# Altium schematic sheet SCH_7Seg.SchDoc
size A4
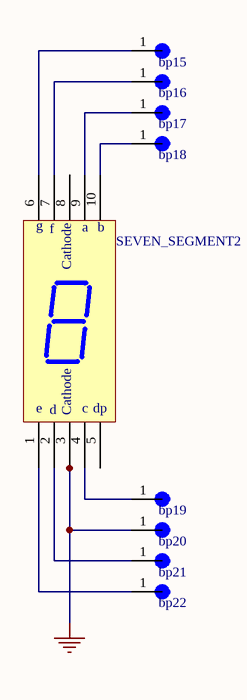
[diagram p0: SCH_7Seg.SchDoc]

## Parts
bp15  Battery Pad  [Battery pad]  (value not drawn)
bp16  Battery Pad  [Battery pad]  (value not drawn)
bp17  Battery Pad  [Battery pad]  (value not drawn)
bp18  Battery Pad  [Battery pad]  (value not drawn)
bp19  Battery Pad  [Battery pad]  (value not drawn)
bp20  Battery Pad  [Battery pad]  (value not drawn)
bp21  Battery Pad  [Battery pad]  (value not drawn)
bp22  Battery Pad  [Battery pad]  (value not drawn)
SEVEN_SEGMENT2  CC_SEVEN_SEGMENT  [7SEG-Avago-Broadcam_HDSP-5551_0]  (value not drawn)

## Nets
GND: bp20.1 SEVEN_SEGMENT2.3 SEVEN_SEGMENT2.8
Netbp15_1: bp15.1 SEVEN_SEGMENT2.6
Netbp16_1: bp16.1 SEVEN_SEGMENT2.7
Netbp17_1: bp17.1 SEVEN_SEGMENT2.9
Netbp18_1: bp18.1 SEVEN_SEGMENT2.10
Netbp19_1: bp19.1 SEVEN_SEGMENT2.4
Netbp21_1: bp21.1 SEVEN_SEGMENT2.2
Netbp22_1: bp22.1 SEVEN_SEGMENT2.1

Not connected (* = marked no-connect by the designer): SEVEN_SEGMENT2 5

## Notes on the sheet
- (in symbol CC_SEVEN_SEGMENT) g; f; a; b; Cathode; e; c; dp; d